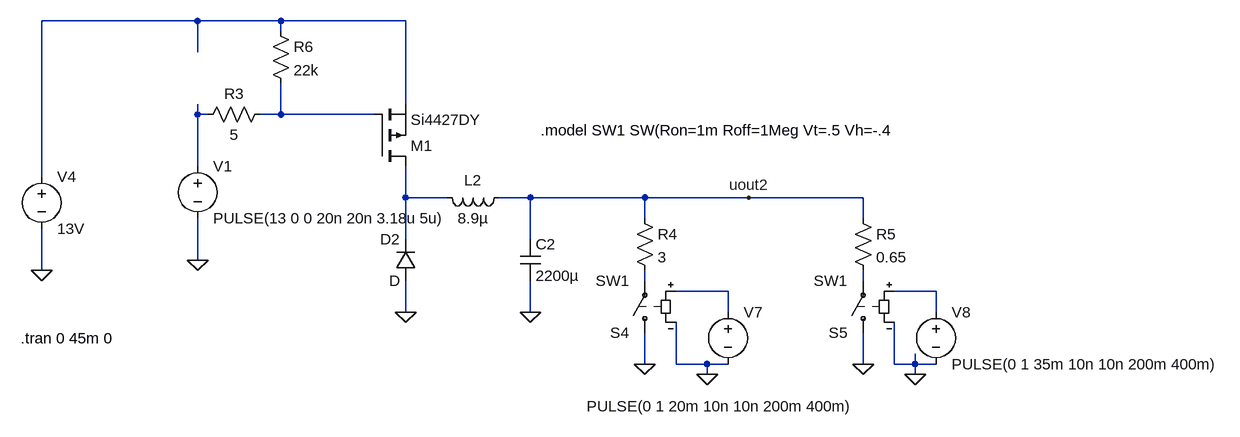
[diagram p0: schematic Buckconverter.asc]
Buckconverter.asc, the LTspice schematic file:
Version 4
SHEET 1 1648 964
WIRE -304 352 -544 352
WIRE -176 352 -304 352
WIRE 16 352 -176 352
WIRE -176 368 -176 352
WIRE -304 400 -304 352
WIRE 16 480 16 352
WIRE -304 496 -304 480
WIRE -288 496 -304 496
WIRE -176 496 -176 448
WIRE -176 496 -208 496
WIRE -32 496 -176 496
WIRE -304 576 -304 496
WIRE -544 592 -544 352
WIRE 16 624 16 576
WIRE 80 624 16 624
WIRE 208 624 160 624
WIRE 384 624 208 624
WIRE 544 624 384 624
WIRE 720 624 544 624
WIRE 384 656 384 624
WIRE 720 656 720 624
WIRE 16 688 16 624
WIRE 208 688 208 624
WIRE -304 720 -304 656
WIRE -544 736 -544 672
WIRE 384 752 384 736
WIRE 720 752 720 736
WIRE 512 768 432 768
WIRE 832 768 768 768
WIRE 16 800 16 752
WIRE 208 800 208 752
WIRE 512 800 512 768
WIRE 832 800 832 768
WIRE 384 880 384 832
WIRE 432 880 432 816
WIRE 480 880 432 880
WIRE 512 880 480 880
WIRE 720 880 720 832
WIRE 768 880 768 816
WIRE 800 880 800 864
WIRE 800 880 768 880
WIRE 832 880 800 880
WIRE 480 896 480 880
WIRE 800 896 800 880
FLAG 208 800 0
FLAG 16 800 0
FLAG -544 736 0
FLAG 384 880 0
FLAG 720 880 0
FLAG 480 896 0
FLAG 800 896 0
FLAG 544 624 uout2
FLAG -304 720 0
SYMBOL ind 176 608 R90
WINDOW 0 5 56 VBottom 2
WINDOW 3 32 56 VTop 2
SYMATTR InstName L2
SYMATTR Value 8.9µ
SYMATTR SpiceLine Rser=1.8m
SYMBOL cap 192 688 R0
SYMATTR InstName C2
SYMATTR Value 2200µ
SYMBOL diode 32 752 R180
WINDOW 0 24 64 Left 2
WINDOW 3 24 0 Left 2
SYMATTR InstName D2
SYMBOL voltage -544 576 R0
WINDOW 123 0 0 Left 2
WINDOW 39 0 0 Left 2
SYMATTR InstName V4
SYMATTR Value 13V
SYMBOL sw 384 848 R180
SYMATTR InstName S4
SYMATTR Value SW1
SYMBOL res 368 640 R0
SYMATTR InstName R4
SYMATTR Value 3
SYMBOL res 704 640 R0
SYMATTR InstName R5
SYMATTR Value 0.65
SYMBOL sw 720 848 R180
SYMATTR InstName S5
SYMATTR Value SW1
SYMBOL voltage 512 784 R0
WINDOW 3 -217 161 Left 2
WINDOW 123 0 0 Left 2
WINDOW 39 0 0 Left 2
SYMATTR Value PULSE(0 1 20m 10n 10n 200m 400m)
SYMATTR InstName V7
SYMBOL voltage 832 784 R0
WINDOW 123 0 0 Left 2
WINDOW 39 0 0 Left 2
SYMATTR InstName V8
SYMATTR Value PULSE(0 1 35m 10n 10n 200m 400m)
SYMBOL res -192 480 R90
WINDOW 0 0 56 VBottom 2
WINDOW 3 32 56 VTop 2
SYMATTR InstName R3
SYMATTR Value 5
SYMBOL pmos -32 576 M180
SYMATTR InstName M1
SYMATTR Value Si4427DY
SYMBOL res -192 352 R0
SYMATTR InstName R6
SYMATTR Value 22k
SYMBOL voltage -304 560 R0
WINDOW 123 0 0 Left 2
WINDOW 39 0 0 Left 2
SYMATTR InstName V1
SYMATTR Value PULSE(13 0 0 20n 20n 3.18u 5u)
TEXT -576 840 Left 2 !.tran 0 45m 0
TEXT 224 520 Left 2 !.model SW1 SW(Ron=1m Roff=1Meg Vt=.5 Vh=-.4

The netlist it stands for:
* Buckconverter.asc
L2 uout2 N004 8.9µ Rser=1.8m
C2 uout2 0 2200µ
D2 0 N004 D
V4 N001 0 13V
S4 0 N005 N007 0 SW1
R4 uout2 N005 3
R5 uout2 N006 0.65
S5 0 N006 N008 0 SW1
V7 N007 0 PULSE(0 1 20m 10n 10n 200m 400m)
V8 N008 0 PULSE(0 1 35m 10n 10n 200m 400m)
R3 N003 N002 5
M1 N004 N003 N001 N001 Si4427DY
R6 N001 N003 22k
V1 N002 0 PULSE(13 0 0 20n 20n 3.18u 5u)
.model D D
.lib standard.dio
.model NMOS NMOS
.model PMOS PMOS
.lib standard.mos
.tran 0 45m 0
.model SW1 SW(Ron=1m Roff=1Meg Vt=.5 Vh=-.4
.backanno
.end